# Altium schematic sheet SupplyDigital.SchDoc
size A3; SheetNumber: 3; SheetTotal: 3
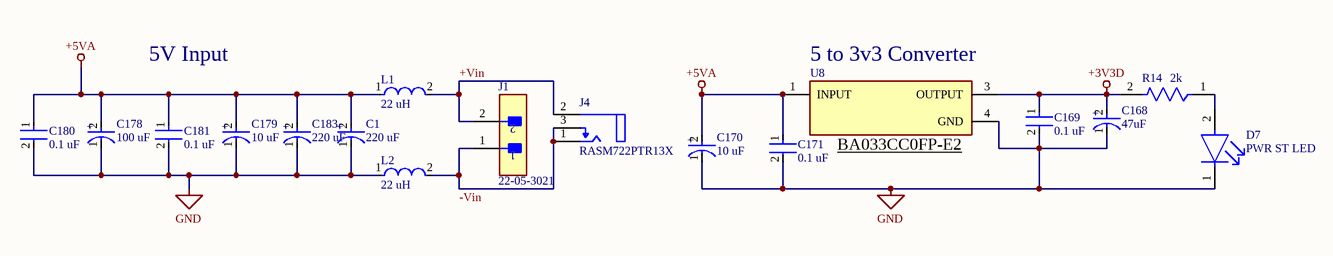
[diagram p0: SupplyDigital.SchDoc]

## Parts
C1  220 uF  [FP-SC-MFG]
C168  47uF  [FP-TAJR-MFG]
C169  0.1 uF  [FP-CC0805-0_85-MFG]
C170  10 uF  [FP-TAJR-MFG]
C171  0.1 uF  [FP-CC0805-0_85-MFG]
C178  100 uF  [FP-TAJR-MFG]
C179  10 uF  [FP-TAJR-MFG]
C180  0.1 uF  [FP-CC0805-0_85-MFG]
C181  0.1 uF  [FP-CC0805-0_85-MFG]
C183  220 uF  [FP-SC-MFG]
D7  PWR ST LED  [FP-APHCM2012SYCK-F01-MFG]
J1  22-05-3021  [FP-22-05-3021-MFG]
J4  RASM722PTR13X  [FP-RASM722PTR13X-MFG]
L1  22 uH  [FP-LQH44PN_P0-MFG]
L2  22 uH  [FP-LQH44PN_P0-MFG]
R14  2k  [FP-RR1220-MFG]
U8  TLV2217-33KVURG3  [FP-KVU0003A-MFG]  (value not drawn)

## Nets
+3V3D: C168.2(A) C169.1 R14.2 U8.3(OUTPUT)
+5VA: C1.2(A) C170.2(A) C171.1 C178.2(A) C179.2(A) C180.1 C181.1 C183.2(A) L1.1 U8.1(INPUT)
GND: C1.1(C) C168.1(C) C169.2 C170.1(C) C171.2 C178.1(C) C179.1(C) C180.2 C181.2 C183.1(C) D7.1(C) L2.1 U8.4(GND)
+Vin: J1.2 J4.2(SLEEVE_TERMINAL) L1.2
-Vin: J1.1 J4.1(TIP_TERMINAL(CENTER_PIN)) J4.3(SHUNT_TERMINAL) L2.2
NetD7_2: D7.2(A) R14.1

## Notes on the sheet
- 5V Input
- (near U8) 5 to 3v3 Converter
- (near U8) BA033CC0FP-E2
- (in symbol CMP-2007-04030-2) +
- (in symbol CMP-05427-000047-1) +

## Library data of the parts
C1 C183 = CMP-05427-000047-1: CAP ALUM 100UF 20% 10V SMD; Life (Hours): 1000Hour; Ripple Current: 50mA; Packaging: Tape and Reel; Diameter: 5mm; Voltage Rating (DC): 10V; Mount: Surface Mount; Max Operating Temperature: 85°C; Length: 5.5mm; Case/Package: Radial; Height: 5.4mm; Construction: Cylindrical; Termination: SMD/SMT; Height - Seated (Max): 0.213inch; Series: S; Min Operating Temperature: -40°C; Capacitance: 100uF; Tolerance: 20%; Voltage Rating: 10V; Package Quantity: 1; Radiation Hardening: No; Ripple Current (AC): 50mA; Lead Free: Lead Free; RoHS Compliant: Yes; Contact Plating: Tin
C168 C170 C178 C179 = CMP-2007-04030-2: 4.7uF 10V  ±10% 9Ω 0805  SMD Tantalum Capacitor; Dissipation Factor: 6%; ESR (Equivalent Series Resistance): 9R; Leakage Current: 500nA; Polarity: Polar; Lead Free: Lead Free; Min Operating Temperature: -55°C; Width: 1.3mm; Depth: 1.3mm; Case Code (Metric): 2012; Features: General Purpose; Length: 2.05mm; Package Quantity: 1; Tolerance: 10%; Height - Seated (Max): 0.047inch; REACH SVHC: No SVHC; Termination: SMD/SMT; Max Operating Temperature: 125°C; Mount: Surface Mount; Case/Package: 0805; Packaging: Tape and Reel; Case Code (Imperial): 0805; Voltage: 10V; Dielectric Material: Tantalum; Weight: 0.000194oz; Construction: Flat; Series: TAJ; Radiation Hardening: No; Voltage Rating: 10V; Height: 1.2mm; Capacitance: 4.7uF; RoHS Compliant: Yes
C169 C171 C180 C181 = CMP-1036-04410-2: CAP CER 0.1UF 25V X7R 0805; Manufacturer Part Number: CC0805KRX7R8BB104; Manufacturer: Yageo; Tolerance: 0.1; Material: Ceramic; Value: 100 nF; ComponentLink2URL: http://www.yageo.com/documents/recent/UPY-GPHC_Y5V_6.3V-to-50V_8.pdf; Category: Cap; Mouser Description: Multilayer Ceramic Capacitors MLCC - SMD/SMT 100nF 25V X7R 10%; Device Class L1: Passive Components; Footprint Url: http://www.yageo.com/exep/pages/download/literatures/UPY-C_GEN_24.pdf; Height: 0.95mm; Digikey Description: CAP CER 0.1UF 25V X7R 0805; Lead Free: Yes; Temperature Range High: +85°C; Temperature: -30°C to +85°C; Ipc Land Pattern Name: CAPC200125X85; Capacitance: 100 nF; Automotive: No; Octopart: https://octopart.com/cc0805krx7r8bb104-yageo-39467766; Device Class L2: Capacitors; Temperature Characteristic: X7R; Voltage Rating: 25 V; ComponentLink2Description: Datasheet; Temperature Range Low: -30°C; Device Class L3: Ceramic Capacitors; RoHS: TRUE; Package: CC0805-0.85
D7 = CMP-44529-000064-1: LED YELLOW CLEAR CHIP SMD; Number of LEDs: 1; Luminous Intensity: 150mcd; Dominant Wavelength: 590nm; Test Current: 20mA; Illumination Color: Green; Forward Voltage: 2V; Viewing Angle: 110°; Number of Pins: 2; Packaging: Tape and Reel; Width: 1.25mm; Height: 0.4mm; Lens Color: Clear; RoHS Compliant: Yes; Lead Free: Lead Free; Min Operating Temperature: -40°C; Case Code (Imperial): 0805; Case/Package: 0805; Series: APHCM; Wavelength: 590nm; Max Operating Temperature: 85°C; Length: 2mm; Color: Yellow; Package Quantity: 2000; Mount: Surface Mount; Lens Style: Clear; Forward Current: 20mA; Case Code (Metric): 2012
J1 = CMP-04776-000166-1: CONN HEADER R/A 2POS 2.54MM; Glow Wire Compliant: Non-compliant; Max Current Rating: 4A; Number of Positions: 2; Contact Resistance: 10mR; Max Voltage Rating (AC): 250V; Gender: Male; Approvals: UL; Contact Material: Brass; Halogen Free: Low Halogen; Depth: 12.83mm; Color: White; Mount: Through Hole; Housing Color: White; Package Quantity: 3000; Series: KK® 7478; Packaging: Bulk; Length: 5.08mm; Fastening Type: Friction; Contact Plating: Tin; Flammability Rating: UL94 V-0; Housing Material: Nylon; Current Rating: 4A; Max Operating Temperature: 75°C; Height: 6.35mm; Lead Free: Lead Free; Pitch: 2.54mm; Termination: Solder; Min Operating Temperature: 0°C; Voltage Rating: 250V; Radiation Hardening: No; Number of Contacts: 2; Contact Mating Length: 0.264inch; Orientation: Right Angle; Contact Type: Male Pin; Number of Rows: 1; Number of Circuits: 2
J4 = CMP-47995-000002-1: CONN PWR JACK 2.1X5.5MM SOLDER; Shielding: Unshielded; Gender: Male; Current Rating: 5A; Termination: Solder; Contact Material: Copper Alloy; Package Quantity: 120; Case/Package: SMD/SMT; Contact Plating: Tin; Connector Type: Jack; Housing Material: Thermoplastic; Mount: Surface Mount; Housing Color: Black; Color: Black
L1 L2 = CMP-06042-015878-1: FIXED IND 4.7UH 1.7A 96 MOHM SMD; Tolerance: 20%; DC Resistance (DCR): 96mR; Core Material: Ferrite; Inductor Type: Chip; Test Frequency: 1MHz; Series Resistance: 80mR; Shielding: Shielded; Self Resonant Frequency: 40MHz; Inductance: 4.7uH; Radiation Hardening: No; Height - Seated (Max): 0.071inch; Inductance Tolerance: 20%; Lead Free: Lead Free; Case Code (Metric): 4040; Series: LQH44P; Max DC Current: 1.7A; Width: 0.157inch; Height: 0.9mm; RoHS Compliant: Yes; REACH SVHC: No SVHC; Resistor Type: Wirewound; Military Standard: Not; Rated Current-Max: 1.7A; Current Rating: 1.7A; DC Current: 1.7A; Length: 4mm; Min Operating Temperature: -40°C; Max Operating Temperature: 85°C; Depth: 4.2mm; Case Code (Imperial): 1515; Package Quantity: 1; Saturation Current: 1.7A; Weight: 0.003527oz; Termination: SMD/SMT; Mount: Surface Mount; Case/Package: 1515; Packaging: Tape and Reel
R14 = CMP-2001-03560-2: 49.9Ω ±0.5% 0.1W 1/10W Chip Resistor 0805 (2012 Metric) Thin Film; Voltage Rating: 100V; Temperature Coefficient: 50ppm/°C; Max Power Dissipation: 100mW; Resistance: 49.9R; Packaging: Tape and Reel; Length: 0.079inch; Termination: SMD/SMT; Case Code (Metric): 2012; Voltage Rating (DC): 100V; Height: 0.02inch; Width: 0.049inch; RoHS Compliant: Yes; Tolerance: 0.5%; Case/Package: 0805; Resistance Tolerance: 0.5%; Lead Free: Lead Free; Size Code: 0805; Min Operating Temperature: -55°C; Max Operating Temperature: 125°C; Case Code (Imperial): 0805; Package Quantity: 1; Resistor Type: Thin Film; Number of Terminations: 2; Power Rating: 100mW; Series: RR
U8 = CMP-04917-000319-1: IC REG LINEAR 3.3V 500MA TO252-3; Number of Outputs: 1; Max Input Voltage: 12V; Min Input Voltage: 3V; Polarity: Positive; Dropout Voltage: 500mV; Output Type: Fixed; Output Voltage Accuracy: 1%; Quiescent Current: 290uA; Case/Package: TO-252; Radiation Hardening: No; Min Operating Temperature: 0°C; Output Current: 500mA; Package Quantity: 1; Packaging: Cut Tape; Mount: Surface Mount; Lead Free: Lead Free; RoHS Compliant: Yes; Contact Plating: Tin; Series: -; Nominal Output Voltage: 3.3V; Number of Pins: 3; REACH SVHC: No SVHC; Max Operating Temperature: 125°C; Number of Regulators: 1; Output Voltage: 3.3V; Input Bias Current: 290uA; Accuracy: 1%; Max Output Current: 500mA